# EAGLE schematic mezza (EAGLE 9.5.2)
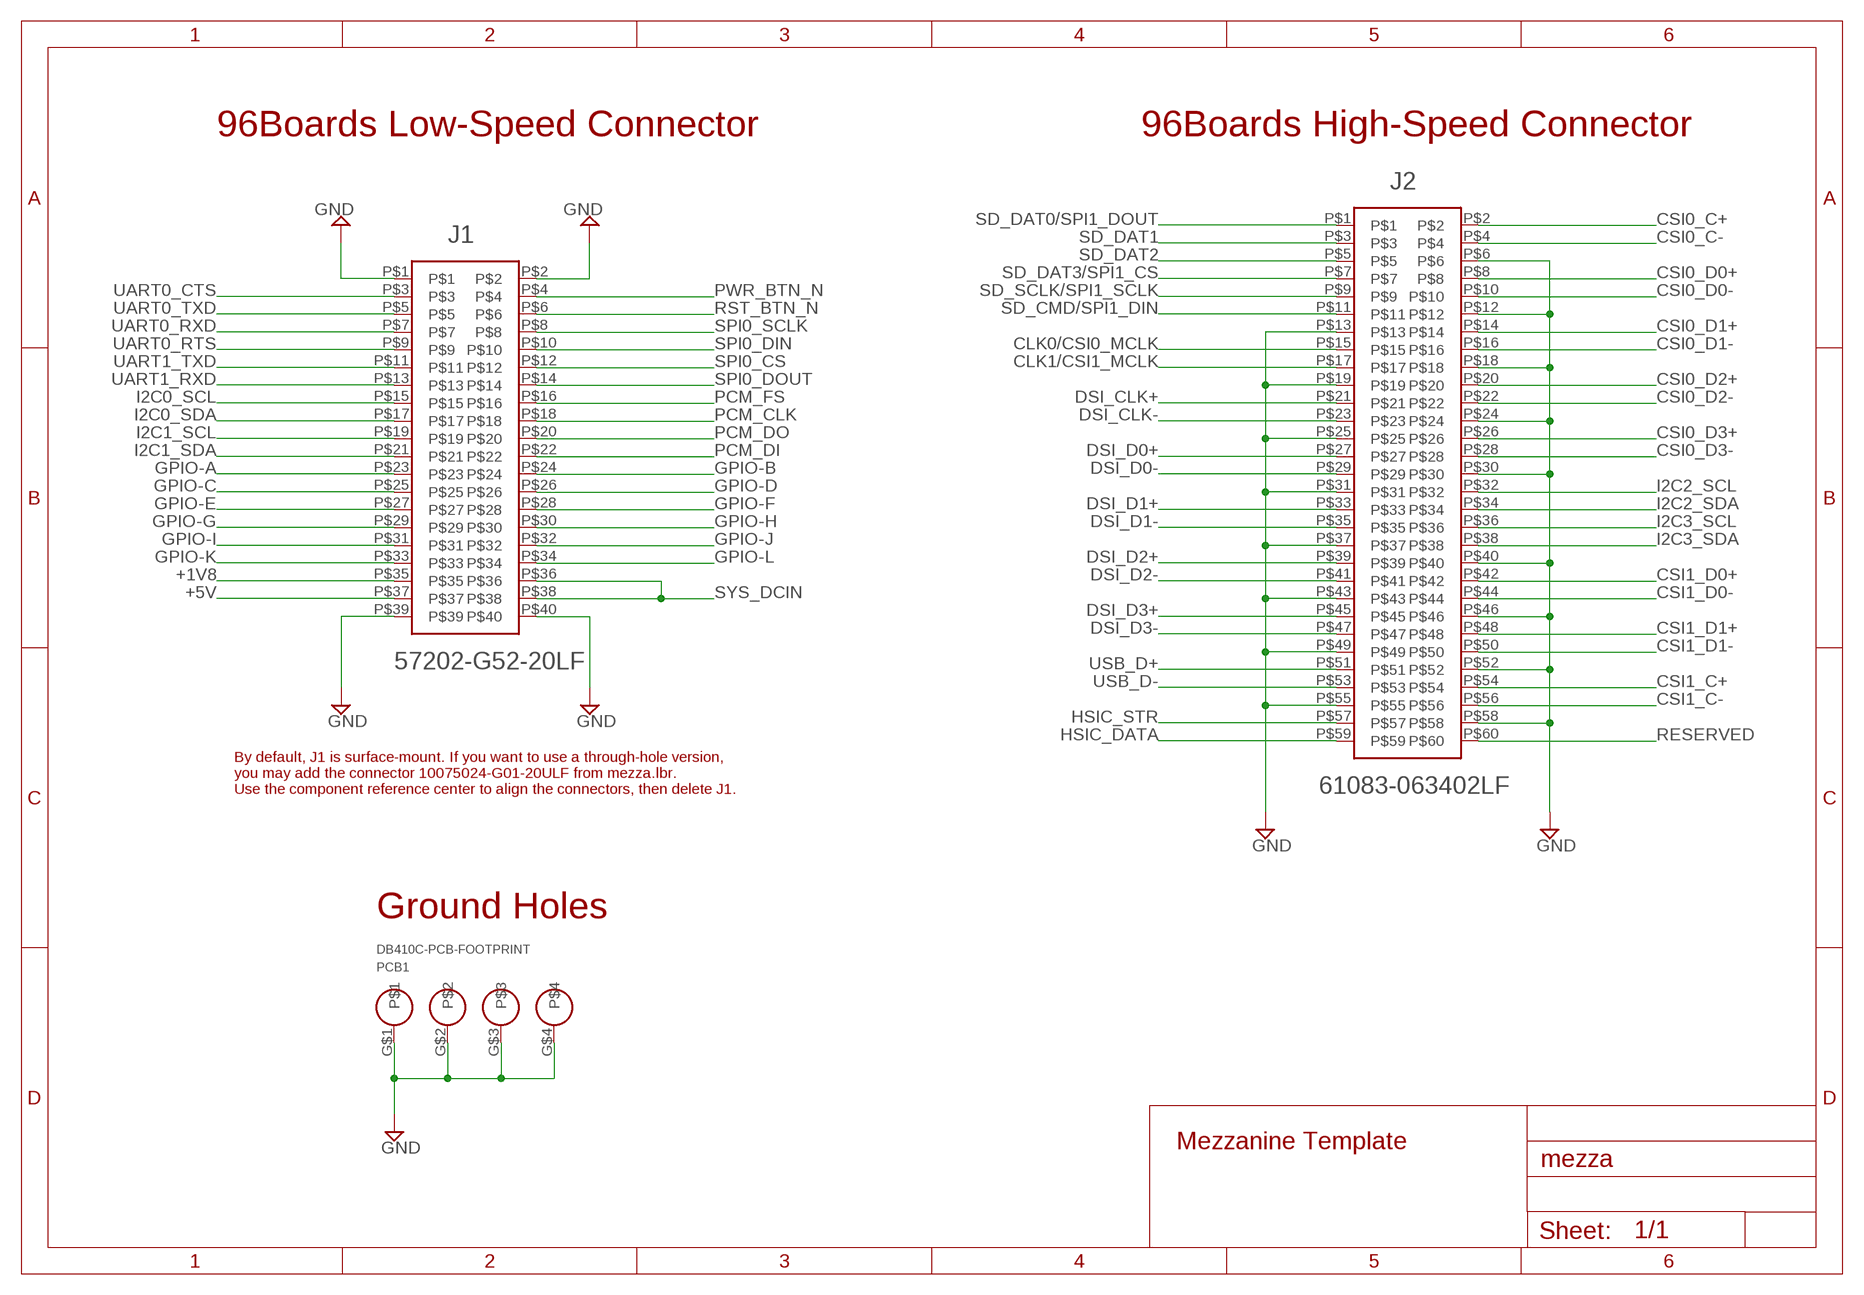
[diagram p0: schematic, sheet 1]

## Parts
J1  57202-G52-20LF  [57202-G52-20LF]
J2  61083-063402LF  [61083-063402LF]
PCB1  DB410C-PCB-FOOTPRINT  [DRAGONBOARD410C]

## Nets
+1V8: J1.P$35
+5V: J1.P$37
CLK0/CSI0_MCLK: J2.P$15
CLK1/CSI1_MCLK: J2.P$17
CSI0_C+: J2.P$2
CSI0_C-: J2.P$4
CSI0_D0+: J2.P$8
CSI0_D0-: J2.P$10
CSI0_D1+: J2.P$14
CSI0_D1-: J2.P$16
CSI0_D2+: J2.P$20
CSI0_D2-: J2.P$22
CSI0_D3+: J2.P$26
CSI0_D3-: J2.P$28
CSI1_C+: J2.P$54
CSI1_C-: J2.P$56
CSI1_D0+: J2.P$42
CSI1_D0-: J2.P$44
CSI1_D1+: J2.P$48
CSI1_D1-: J2.P$50
DSI_CLK+: J2.P$21
DSI_CLK-: J2.P$23
DSI_D0+: J2.P$27
DSI_D0-: J2.P$29
DSI_D1+: J2.P$33
DSI_D1-: J2.P$35
DSI_D2+: J2.P$39
DSI_D2-: J2.P$41
DSI_D3+: J2.P$45
DSI_D3-: J2.P$47
GND: J1.P$1 J1.P$2 J1.P$39 J1.P$40 J2.P$6 J2.P$12 J2.P$13 J2.P$18 J2.P$19 J2.P$24 J2.P$25 J2.P$30 J2.P$31 J2.P$37 J2.P$40 J2.P$43 J2.P$46 J2.P$49 J2.P$52 J2.P$55 J2.P$58 PCB1.G$1 PCB1.G$2 PCB1.G$3 PCB1.G$4
GPIO-A: J1.P$23
GPIO-B: J1.P$24
GPIO-C: J1.P$25
GPIO-D: J1.P$26
GPIO-E: J1.P$27
GPIO-F: J1.P$28
GPIO-G: J1.P$29
GPIO-H: J1.P$30
GPIO-I: J1.P$31
GPIO-J: J1.P$32
GPIO-K: J1.P$33
GPIO-L: J1.P$34
HSIC_DATA: J2.P$59
HSIC_STR: J2.P$57
I2C0_SCL: J1.P$15
I2C0_SDA: J1.P$17
I2C1_SCL: J1.P$19
I2C1_SDA: J1.P$21
I2C2_SCL: J2.P$32
I2C2_SDA: J2.P$34
I2C3_SCL: J2.P$36
I2C3_SDA: J2.P$38
PCM_CLK: J1.P$18
PCM_DI: J1.P$22
PCM_DO: J1.P$20
PCM_FS: J1.P$16
PWR_BTN_N: J1.P$4
RESERVED: J2.P$60
RST_BTN_N: J1.P$6
SD_CMD/SPI1_DIN: J2.P$11
SD_DAT0/SPI1_DOUT: J2.P$1
SD_DAT1: J2.P$3
SD_DAT2: J2.P$5
SD_DAT3/SPI1_CS: J2.P$7
SD_SCLK/SPI1_SCLK: J2.P$9
SPI0_CS: J1.P$12
SPI0_DIN: J1.P$10
SPI0_DOUT: J1.P$14
SPI0_SCLK: J1.P$8
SYS_DCIN: J1.P$36 J1.P$38
UART0_CTS: J1.P$3
UART0_RTS: J1.P$9
UART0_RXD: J1.P$7
UART0_TXD: J1.P$5
UART1_RXD: J1.P$13
UART1_TXD: J1.P$11
USB_D+: J2.P$51
USB_D-: J2.P$53

## Notes on the sheet
- 96Boards Low-Speed Connector | 96Boards High-Speed Connector
- By default, J1 is surface-mount. If you want to use a through-hole version, 
  you may add the connector 10075024-G01-20ULF from mezza.lbr.
  Use the component reference center to align the connectors, then delete J1.
- Ground Holes
- Mezzanine Template

## Library data of the parts
J1 = mezza:57202-G52-20LF
J2 = mezza:61083-063402LF: 61083-063402LF Amphenol FCI 61083-063402LF Connector Headers and PCB Receptacles MANUFACTURER : Amphenol FCI DESCRIPTION : Conn Fine Pitch Connector PL 60 POS 0.8mm Solder ST SMD T/R Note: DragonBoard 410c HS Connector This fine pitch connector 61083-063402LF header connector from FCI reduces the possibility of accidentally shorting pins when a board is being used. This PL connector's 60 contacts that are made out of brass and plated with gold over nickel. It has a plug type gender. Its pitch is 0.8 mm. It has a straight body orientation. It has a maximum voltage rating of 100 VAC. This is a 2-row connector. This device has a maximum current rating of 0.8 A/contact. Tape and reel packaging will encase the product during shipment, ensuring safe delivery and enabling quick mounting of components. This product is 29.8 mm long, 6.7 mm tall and 6 mm deep. 61083-063402LF is housed in liquid crystal polymer. It uses the solder termination method. This connector has an operating temperature of -40 to 125 °C.
PCB1 = mezza:DB410C-PCB-FOOTPRINT